# Altium schematic sheet Servo_controller.SchDoc
size A4; SheetNumber: 4; SheetTotal: 8
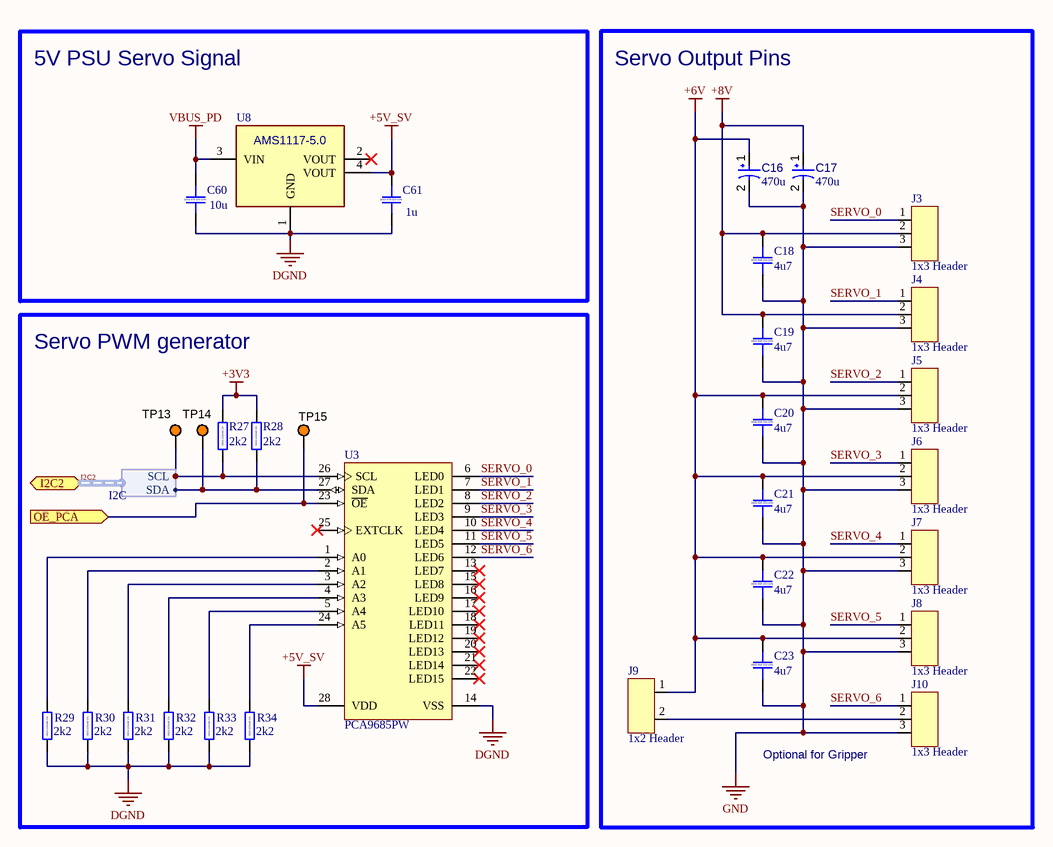
[diagram p0: Servo_controller.SchDoc]

## Parts
C16  value 470u  [CAPPR65-500-2000X1000X2200]  (hidden comment: CAP_TH_5)
C17  value 470u  [CAPPR65-500-2000X1000X2200]  (hidden comment: CAP_TH_5)
C18  4u7  [CAP_0805]
C19  4u7  [CAP_0805]
C20  4u7  [CAP_0805]
C21  4u7  [CAP_0805]
C22  4u7  [CAP_0805]
C23  4u7  [CAP_0805]
C60  10u  [CAP_0603]
C61  1u  [CAP_0603]
J3  1x3 Header  [1x4 Header-Footprint-1]
J4  1x3 Header  [1x4 Header-Footprint-1]
J5  1x3 Header  [1x4 Header-Footprint-1]
J6  1x3 Header  [1x4 Header-Footprint-1]
J7  1x3 Header  [1x4 Header-Footprint-1]
J8  1x3 Header  [1x4 Header-Footprint-1]
J9  1x2 Header  [1x2 Header-Footprint-1]
J10  1x3 Header  [1x4 Header-Footprint-1]
R27  2k2  [RES_0603]
R28  2k2  [RES_0603]
R29  2k2  [RES_0603]
R30  2k2  [RES_0603]
R31  2k2  [RES_0603]
R32  2k2  [RES_0603]
R33  2k2  [RES_0603]
R34  2k2  [RES_0603]
TP13  5003  [KSTN-5003]  (value not drawn)
TP14  5003  [KSTN-5003]  (value not drawn)
TP15  5003  [KSTN-5003]  (value not drawn)
U3  PCA9685PW  [SOT361-1_V]
U8  AMS1117-5.0  [FP-AMS1117-IPC_B]  (value not drawn)

## Blocks framed on the sheet
5V PSU Servo Signal: C60 C61 U8
Servo Output Pins: C16-C23 J3-J10
Servo PWM generator: R27-R34 TP13-TP15 U3

## Ports
I2C2 (bidir, harness I2C), OE_PCA (in)

## Harnesses
I2C: SCL, SDA

## Nets
+3V3: R27.2 R28.2
+5V_SV: C61.1 U3.28(VDD) U8.4(VOUT)
+6V: C16.1 C20.2 C21.2 C22.2 C23.2 J5.2 J6.2 J7.2 J8.2 J9.1
+8V: C17.1 C18.2 C19.2 J3.2 J4.2
DGND: C60.2 C61.2 R29.1 R30.1 R31.1 R32.1 R33.1 R34.1 U3.14(VSS) U8.1(GND)
GND: C16.2 C17.2 C18.1 C19.1 C20.1 C21.1 C22.1 C23.1 J3.3 J4.3 J5.3 J6.3 J7.3 J8.3 J10.3
VBUS_PD: C60.1 U8.3(VIN)
I2C2.SCL: R27.1 TP13.1 U3.26(SCL) ; port I2C2.SCL
I2C2.SDA: R28.1 TP14.1 U3.27(SDA) ; port I2C2.SDA
OE_PCA: TP15.1 U3.23(~{OE}) ; port OE_PCA
SERVO_0: J3.1 U3.6(LED0)
SERVO_1: J4.1 U3.7(LED1)
SERVO_2: J5.1 U3.8(LED2)
SERVO_3: J6.1 U3.9(LED3)
SERVO_4: J7.1 U3.10(LED4)
SERVO_5: J8.1 U3.11(LED5)
SERVO_6: J10.1 U3.12(LED6)
NetJ9_2: J9.2 J10.2
NetR29_2: R29.2 U3.1(A0)
NetR30_2: R30.2 U3.2(A1)
NetR31_2: R31.2 U3.3(A2)
NetR32_2: R32.2 U3.4(A3)
NetR33_2: R33.2 U3.5(A4)
NetR34_2: R34.2 U3.24(A5)

Not connected (* = marked no-connect by the designer): U3 13(LED7)* 15(LED8)* 16(LED9)* 17(LED10)* 18(LED11)* 19(LED12)* 20(LED13)* 21(LED14)* 22(LED15)* 25(EXTCLK)*; U8 2(VOUT)*

## Buses and harness runs
harness I2C2 = port I2C2

## Notes on the sheet
- (near J10) Optional for Gripper
- (in symbol CMP-001-00113-3) 0603 X7R 50V 10%
- (in symbol CMP-001-38826-1) 0805 X5R 25V 10%
- (in symbol CMP-009-00179-5) 0603 100mW 1%

## Library data of the parts
C16 C17 = CMP-001-38829-1: Aluminum Electrolytic Capacitor, 2-Pin THD; Manufacturer: Panasonic; Voltage Rating: 50V; Ripple Current: 650mA; Tolerance: 20%; Packaging: Bulk; Package Reference: CAPPR65-500-2000X1000X2200; Pins: 2; Manufacturer URL: http://www.panasonic.com/; Datasheet Version: Mar-16; Case/Package: Radial; Package Quantity: 200; Datasheet URL: http://industrial.panasonic.com/cdbs/www-data/pdf/RDF0000/ABA0000C1047.pdf; RoHS Compliant: True; Package Description: 2-Pin Radial Lead, Dia 10 mm, Height 22 mm; Lead Pitch: 5mm; Capacitor Type: Electrolytic; Max Operating Temperature: 85°C; Ripple Current (AC): 650mA; Mounting Technology: TH; Min Operating Temperature: -40°C; Diameter: 10mm
C18-C23 = CMP-001-38826-1: Capacitor SMD 0805; Manufacturer Part Number: *; Rating: *; Dielectric: *; Design Item ID: CAP_0805; Manufacturer: *; Value: 4u7; Distributor Link: *; LCSC: *; Source: Schematic-Lib-PhilsLab.SchLib
C60 C61 = CMP-001-00113-3: Capacitor SMD 0603; Manufacturer: *; Rating: *; Distributor Link: *; Source: Schematic-Lib-PhilsLab.SchLib; Manufacturer Part Number: *; Dielectric: *; LCSC: *; Design Item ID: CAP_0603
J3-J8 J10 = CMP-002-00332-2: TE 5-146280-3, PCB Mount Header, Vertical, Board-to-Board, 3 Position, 2.54 mm [.1 in] Centerline, Breakaway, Gold, Through Hole - Solder, Signal, AMPMODU Headers
J9 = CMP-002-00330-3: TE 5-146280-2, PCB Mount Header, Vertical, Board-to-Board, 2 Position, 2.54 mm [.1 in] Centerline, Breakaway, Gold, Through Hole - Solder, Signal, AMPMODU Headers
R27-R34 = CMP-009-00179-5: Resistor 0603 100mW 1%; LCSC: *; Value: 2k2; Distributor Link: *; Manufacturer Part Number: *; Design Item ID: RES_0603; Manufacturer: *; Source: Schematic-Lib-PhilsLab.SchLib
TP13-TP15 = CMP-002-00037-2: Test Point, Orange, Height 4.6 mm, Tail Length 3 mm, 1-Pin THD, RoHS; Manufacturer: Keystone; Colour: Orange; Packaging: Bulk; Package Description: 1-Pin Through Hole Device, Dia 2.54 mm; Pins: 1; Package Reference: 5003; Datasheet Version: Jun-15; Case/Package: 5003; Mounting Technology: TH; Connector Type: TestPoint; Diameter: 2.54mm; Contact Material: Bronze; Datasheet URL: http://keyelco.com/userAssets/file/M65p56.pdf; Manufacturer URL: http://www.keyelco.com/; Package Quantity: 10; Contact Plating: Tin; RoHS Compliant: True
U3 = CMP-1595-00004-2: 16-Channel, 12-Bit PWM Fm+ I2C-Bus LED Controller, 2.3 to 5.5 V, -40 to 85 degC, 28-Pin TSSOP (SOT361-1), RoHS, Tape and Reel; Supply Current Max: 10 mA; Supply Voltage Min: 2.3 V; Supply Voltage Max: 5.5 V; Frequency: 25000000 Hz; Temperature Min: -40 degC; PackageDescription: 28-Pin Small Outline Package, Body 9.7 x 4.4 mm, Pitch 0.65 mm; RoHS: TRUE; ComponentLink1Description: Manufacturer URL; Code_JEDEC: MO-153; PartNumber: PCA9685; ComponentLink2URL: http://www.nxp.com/documents/data_sheet/PCA9685.pdf; Packing: Tape and Reel; ComponentLink1URL: http://www.nxp.com/; ComponentLink3Description: Package Specification; ComponentLink2Description: Datasheet; ComponentLink3URL: http://www.nxp.com/documents/outline_drawing/sot361-1_po.pdf; DatasheetVersion: Rev. 4; Temperature Max: 85 degC; PackageVersion: 02/2003; Mounting Technology: Surface Mount
U8 = CMP-019-00050-1: Fixed Positive LDO Regulator, 5.0V, 1.3V Dropout, PDSO3; Pins: 3; Case/Package: SOP; RoHS Compliant: Yes